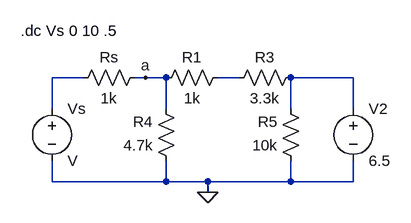
[diagram p0: schematic Circuit 3.asc]
Circuit 3.asc, the LTspice schematic file:
Version 4
SHEET 1 880 680
WIRE 48 48 0 48
WIRE 144 48 128 48
WIRE 176 48 144 48
WIRE 288 48 256 48
WIRE 464 48 368 48
WIRE 0 96 0 48
WIRE 176 96 176 48
WIRE 368 96 368 48
WIRE 464 96 464 48
WIRE 0 208 0 176
WIRE 176 208 176 176
WIRE 176 208 0 208
WIRE 240 208 176 208
WIRE 368 208 368 176
WIRE 368 208 240 208
WIRE 464 208 464 176
WIRE 464 208 368 208
WIRE 240 224 240 208
FLAG 144 48 a
FLAG 240 224 0
SYMBOL res 32 64 R270
WINDOW 0 32 56 VTop 2
WINDOW 3 0 56 VBottom 2
SYMATTR InstName Rs
SYMATTR Value 1k
SYMBOL res 272 32 R90
WINDOW 0 0 56 VBottom 2
WINDOW 3 32 56 VTop 2
SYMATTR InstName R1
SYMATTR Value 1k
SYMBOL res 384 32 R90
WINDOW 0 0 56 VBottom 2
WINDOW 3 32 56 VTop 2
SYMATTR InstName R3
SYMATTR Value 3.3k
SYMBOL res 192 192 R180
WINDOW 0 36 76 Left 2
WINDOW 3 36 40 Left 2
SYMATTR InstName R4
SYMATTR Value 4.7k
SYMBOL res 384 192 R180
WINDOW 0 36 76 Left 2
WINDOW 3 36 40 Left 2
SYMATTR InstName R5
SYMATTR Value 10k
SYMBOL voltage 0 80 R0
SYMATTR InstName Vs
SYMBOL voltage 464 80 R0
SYMATTR InstName V2
SYMATTR Value 6.5
TEXT -48 -24 Left 2 !.dc Vs 0 10 .5

The netlist it stands for:
* Circuit 3.asc
Rs N001 a 1k
R1 N002 a 1k
R3 N003 N002 3.3k
R4 0 a 4.7k
R5 0 N003 10k
Vs N001 0 V
V2 N003 0 6.5
.dc Vs 0 10 .5
.backanno
.end